# Altium schematic sheet FPGA.SchDoc
size A2; Author: ALTIUM GOSTBOM2.0 KEV; SheetNumber: 2; SheetTotal: 7
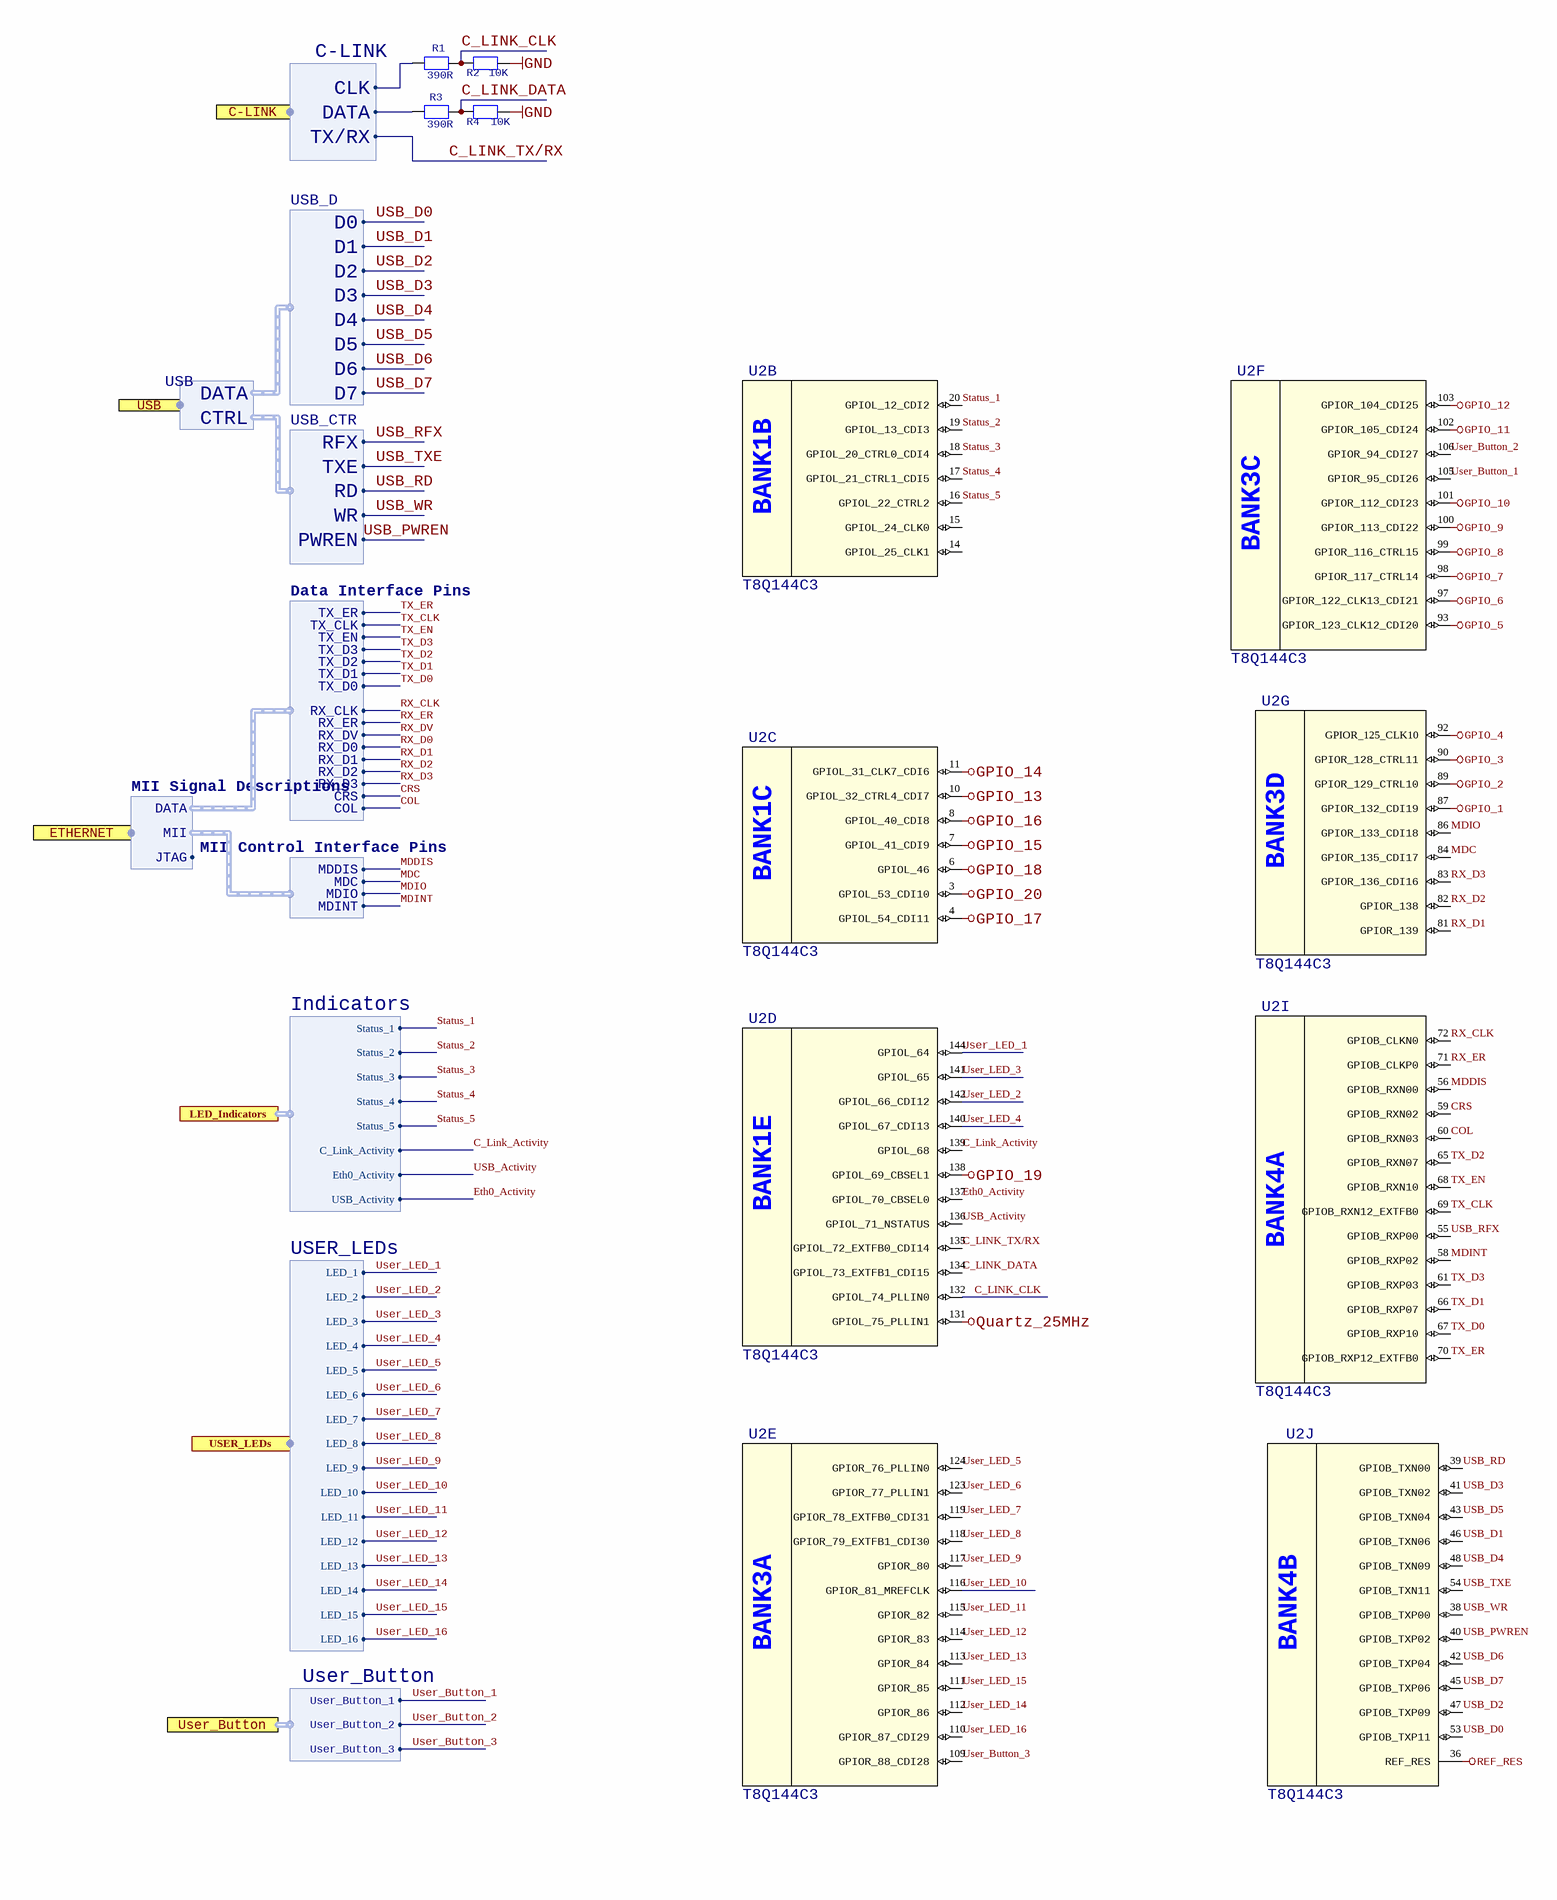
[diagram p0: FPGA.SchDoc, left]
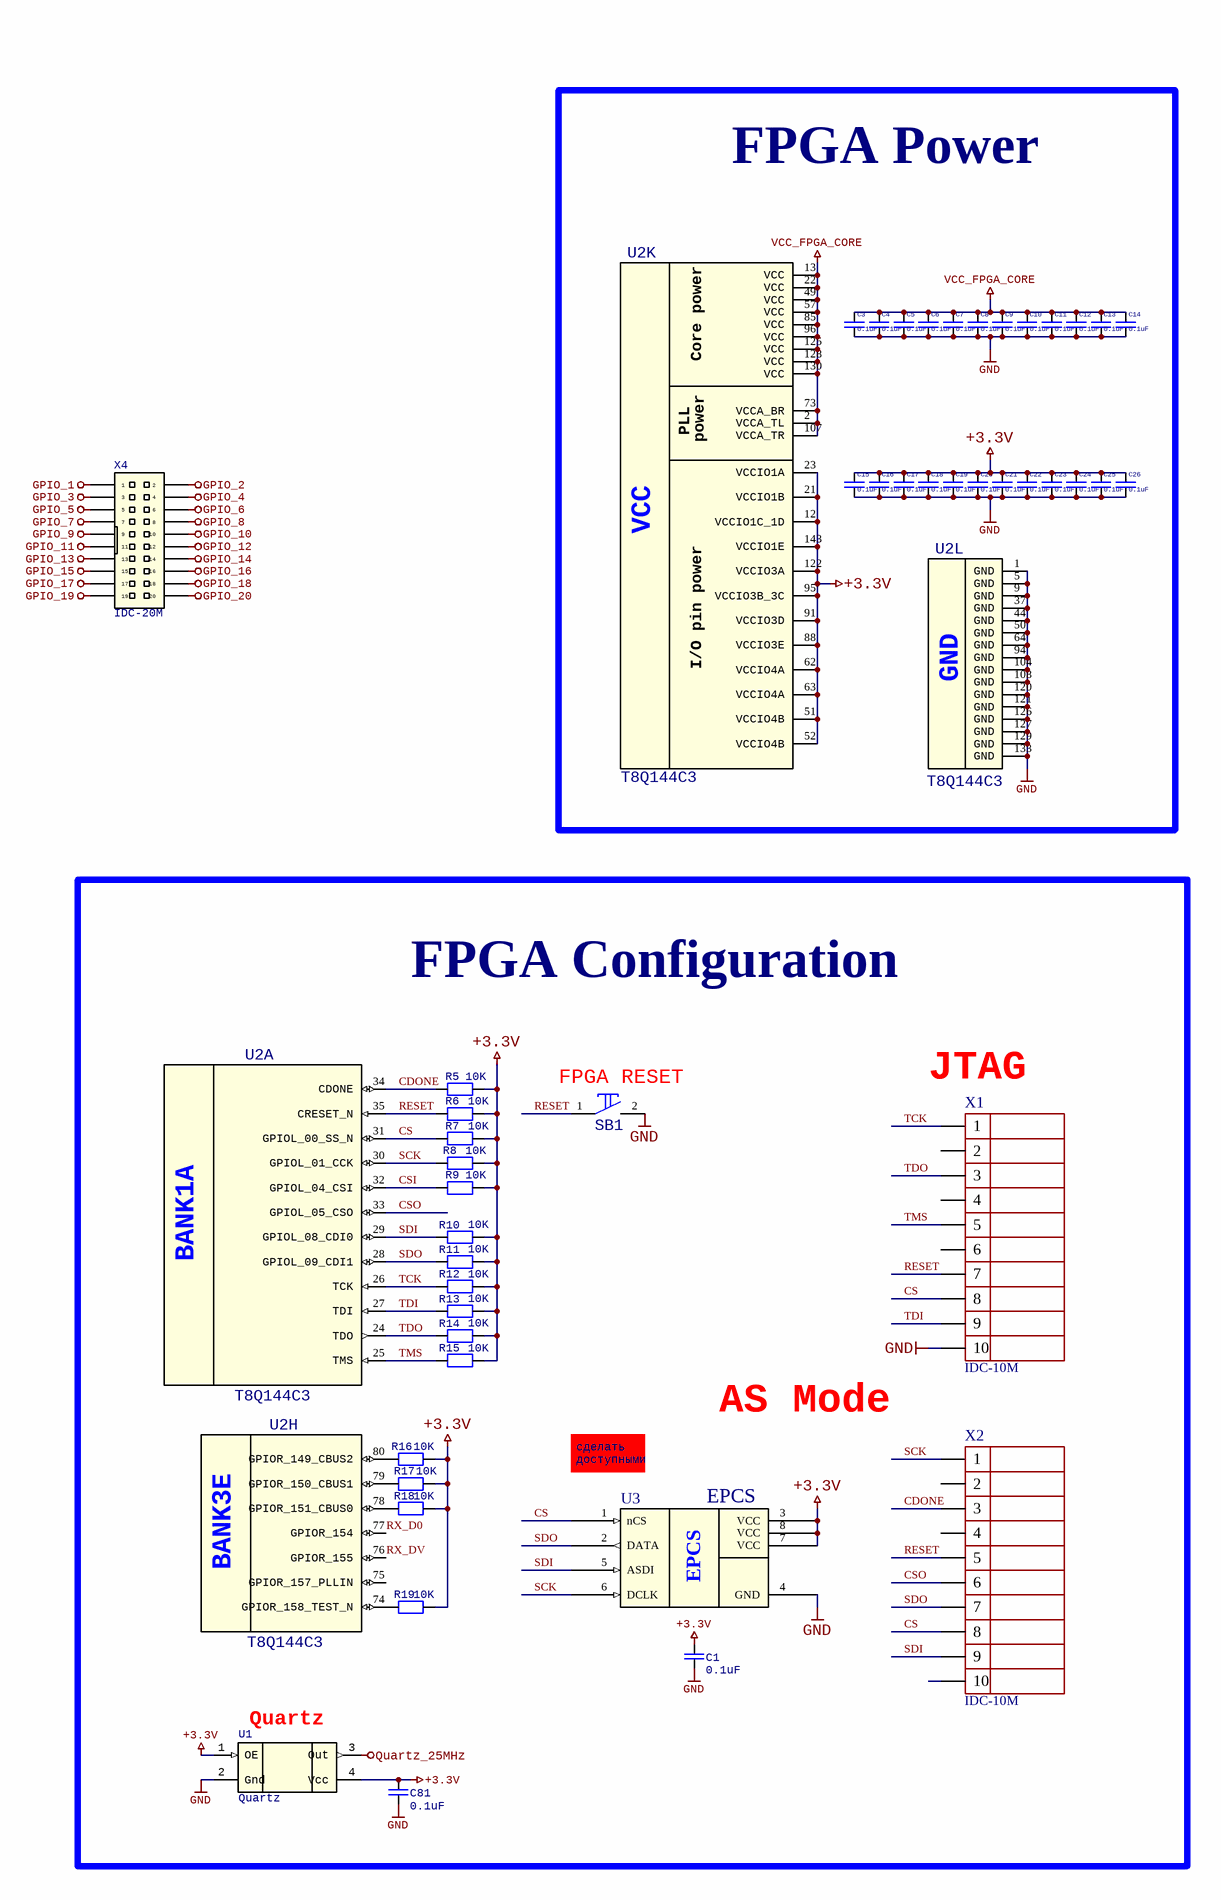
[diagram p1: FPGA.SchDoc, right]

## Parts
C1  0.1uF  [C_0603]
C3  0.1uF  [C_0603]
C4  0.1uF  [C_0603]
C5  0.1uF  [C_0603]
C6  0.1uF  [C_0603]
C7  0.1uF  [C_0603]
C8  0.1uF  [C_0603]
C9  0.1uF  [C_0603]
C10  0.1uF  [C_0603]
C11  0.1uF  [C_0603]
C12  0.1uF  [C_0603]
C13  0.1uF  [C_0603]
C14  0.1uF  [C_0603]
C15  0.1uF  [C_0603]
C16  0.1uF  [C_0603]
C17  0.1uF  [C_0603]
C18  0.1uF  [C_0603]
C19  0.1uF  [C_0603]
C20  0.1uF  [C_0603]
C21  0.1uF  [C_0603]
C22  0.1uF  [C_0603]
C23  0.1uF  [C_0603]
C24  0.1uF  [C_0603]
C25  0.1uF  [C_0603]
C26  0.1uF  [C_0603]
C81  0.1uF  [C_0603]
R1  390R  [R_0603]
R2  10K  [R_0603]
R3  390R  [R_0603]
R4  10K  [R_0603]
R5  10K  [R_0603]
R6  10K  [R_0603]
R7  10K  [R_0603]
R8  10K  [R_0603]
R9  10K  [R_0603]
R10  10K  [R_0603]
R11  10K  [R_0603]
R12  10K  [R_0603]
R13  10K  [R_0603]
R14  10K  [R_0603]
R15  10K  [R_0603]
R16  10K  [R_0603]
R17  10K  [R_0603]
R18  10K  [R_0603]
R19  10K  [R_0603]
SB1  Text  [DTS-32]  (value not drawn)
U1  Quartz  [SMD_Qz_7mmX5mm]
U2  T8Q144C3  [LQFP- 144]  (parts A,B,C,D,E,F,G,H,I,J,K,L of 12)
U3  EPCS  [SOIC8_N]
X1  IDC-10M  [IDC-10MS]
X2  IDC-10M  [IDC-10MS]
X4  IDC-20M  [IDC-20]

## Blocks framed on the sheet
FPGA Power: C3-C26 U2
FPGA Configuration: C1 C81 R5-R19 SB1 U1-U3 X1 X2

## Ports
C-LINK (harness C-LINK), ETHERNET (harness MII Signal Descriptions), LED_Indicators (harness Indicators), USB (harness USB), User_Button (harness User_Button), USER_LEDs (harness USER_LEDs)

## Harnesses
C-LINK: CLK, DATA, TX/RX
USB_D: D0, D1, D2, D3, D4, D5, D6, D7
USB_CTR: RFX, TXE, RD, WR, PWREN
USB: DATA, CTRL
MII Control Interface Pins: MDDIS, MDC, MDIO, MDINT
Data Interface Pins: TX_ER, TX_CLK, TX_EN, TX_D3, TX_D2, TX_D1, TX_D0, RX_CLK, RX_ER, RX_DV, RX_D0, RX_D1, RX_D2, RX_D3, CRS, COL
MII Signal Descriptions: MII, DATA, JTAG
USER_LEDs: LED_1, LED_2, LED_3, LED_4, LED_5, LED_6, LED_7, LED_8, LED_9, LED_10, LED_11, LED_12, LED_13, LED_14, LED_15, LED_16
User_Button: User_Button_1, User_Button_2, User_Button_3
Indicators: Eth0_Activity, USB_Activity, C_Link_Activity, Status_5, Status_4, Status_3, Status_2, Status_1

## Nets
+3.3V: C1.1 C15.1 C16.1 C17.1 C18.1 C19.1 C20.1 C21.1 C22.1 C23.1 C24.1 C25.1 C26.1 C81.2 R5.2 R6.2 R7.2 R8.2 R9.2 R10.2 R11.2 R12.2 R13.2 R14.2 R15.2 R16.2 R17.2 R18.2 R19.2 U1.1(OE) U1.4(Vcc) U2.12(VCCIO1C_1D) U2.21(VCCIO1B) U2.23(VCCIO1A) U2.51(VCCIO4B) U2.52(VCCIO4B) U2.62(VCCIO4A) U2.63(VCCIO4A) U2.88(VCCIO3E) U2.91(VCCIO3D) U2.95(VCCIO3B_3C) U2.122(VCCIO3A) U2.143(VCCIO1E) U3.3(VCC) U3.7(VCC) U3.8(VCC)
GND: C1.2 C3.2 C4.2 C5.2 C6.2 C7.2 C8.2 C9.2 C10.2 C11.2 C12.2 C13.2 C14.2 C15.2 C16.2 C17.2 C18.2 C19.2 C20.2 C21.2 C22.2 C23.2 C24.2 C25.2 C26.2 C81.1 R2.2 R4.2 SB1.2 U1.2(Gnd) U2.1(GND) U2.5(GND) U2.9(GND) U2.37(GND) U2.44(GND) U2.50(GND) U2.64(GND) U2.94(GND) U2.104(GND) U2.108(GND) U2.120(GND) U2.121(GND) U2.126(GND) U2.127(GND) U2.129(GND) U2.133(GND) U3.4(GND) X1.10
GPIO_1: U2.87(GPIOR_132_CDI19) X4.1
GPIO_2: U2.89(GPIOR_129_CTRL10) X4.2
GPIO_3: U2.90(GPIOR_128_CTRL11) X4.3
GPIO_4: U2.92(GPIOR_125_CLK10) X4.4
GPIO_5: U2.93(GPIOR_123_CLK12_CDI20) X4.5
GPIO_6: U2.97(GPIOR_122_CLK13_CDI21) X4.6
GPIO_7: U2.98(GPIOR_117_CTRL14) X4.7
GPIO_8: U2.99(GPIOR_116_CTRL15) X4.8
GPIO_9: U2.100(GPIOR_113_CDI22) X4.9
GPIO_10: U2.101(GPIOR_112_CDI23) X4.10
GPIO_11: U2.102(GPIOR_105_CDI24) X4.11
GPIO_12: U2.103(GPIOR_104_CDI25) X4.12
GPIO_13: U2.10(GPIOL_32_CTRL4_CDI7) X4.13
GPIO_14: U2.11(GPIOL_31_CLK7_CDI6) X4.14
GPIO_15: U2.7(GPIOL_41_CDI9) X4.15
GPIO_16: U2.8(GPIOL_40_CDI8) X4.16
GPIO_17: U2.4(GPIOL_54_CDI11) X4.17
GPIO_18: U2.6(GPIOL_46) X4.18
GPIO_19: U2.138(GPIOL_69_CBSEL1) X4.19
GPIO_20: U2.3(GPIOL_53_CDI10) X4.20
Quartz_25MHz: U1.3(Out) U2.131(GPIOL_75_PLLIN1)
REF_RES: U2.36(REF_RES)
VCC_FPGA_CORE: C3.1 C4.1 C5.1 C6.1 C7.1 C8.1 C9.1 C10.1 C11.1 C12.1 C13.1 C14.1 U2.2(VCCA_TL) U2.13(VCC) U2.22(VCC) U2.49(VCC) U2.57(VCC) U2.73(VCCA_BR) U2.85(VCC) U2.96(VCC) U2.107(VCCA_TR) U2.125(VCC) U2.128(VCC) U2.130(VCC)
C_Link_Activity: U2.139(GPIOL_68) ; port LED_Indicators.C_Link_Activity
C_LINK_CLK: R1.2 R2.1 U2.132(GPIOL_74_PLLIN0)
C_LINK_DATA: R3.2 R4.1 U2.134(GPIOL_73_EXTFB1_CDI15)
C_LINK_TX/RX: U2.135(GPIOL_72_EXTFB0_CDI14) ; port C-LINK.TX/RX
CDONE: R5.1 U2.34(CDONE) X2.3
COL: U2.60(GPIOB_RXN03) ; harness Data Interface Pins.COL
CRS: U2.59(GPIOB_RXN02) ; harness Data Interface Pins.CRS
CS: R7.1 U2.31(GPIOL_00_SS_N) U3.1(nCS) X1.8 X2.8
CSI: R9.1 U2.32(GPIOL_04_CSI)
CSO: U2.33(GPIOL_05_CSO) X2.6
Eth0_Activity: U2.137(GPIOL_70_CBSEL0) ; port LED_Indicators.USB_Activity
MDC: U2.84(GPIOR_135_CDI17) ; harness MII Control Interface Pins.MDC
MDDIS: U2.56(GPIOB_RXN00) ; harness MII Control Interface Pins.MDDIS
MDINT: U2.58(GPIOB_RXP02) ; harness MII Control Interface Pins.MDINT
MDIO: U2.86(GPIOR_133_CDI18) ; harness MII Control Interface Pins.MDIO
RESET: R6.1 SB1.1 U2.35(CRESET_N) X1.7 X2.5
RX_CLK: U2.72(GPIOB_CLKN0) ; harness Data Interface Pins.RX_CLK
RX_D0: U2.77(GPIOR_154) ; harness Data Interface Pins.RX_D0
RX_D1: U2.81(GPIOR_139) ; harness Data Interface Pins.RX_D1
RX_D2: U2.82(GPIOR_138) ; harness Data Interface Pins.RX_D2
RX_D3: U2.83(GPIOR_136_CDI16) ; harness Data Interface Pins.RX_D3
RX_DV: U2.76(GPIOR_155) ; harness Data Interface Pins.RX_DV
RX_ER: U2.71(GPIOB_CLKP0) ; harness Data Interface Pins.RX_ER
SCK: R8.1 U2.30(GPIOL_01_CCK) U3.6(DCLK) X2.1
SDI: R10.1 U2.29(GPIOL_08_CDI0) U3.5(ASDI) X2.9
SDO: R11.1 U2.28(GPIOL_09_CDI1) U3.2(DATA) X2.7
Status_1: U2.20(GPIOL_12_CDI2) ; port LED_Indicators.Status_1
Status_2: U2.19(GPIOL_13_CDI3) ; port LED_Indicators.Status_2
Status_3: U2.18(GPIOL_20_CTRL0_CDI4) ; port LED_Indicators.Status_3
Status_4: U2.17(GPIOL_21_CTRL1_CDI5) ; port LED_Indicators.Status_4
Status_5: U2.16(GPIOL_22_CTRL2) ; port LED_Indicators.Status_5
TCK: R12.1 U2.26(TCK) X1.1
TDI: R13.1 U2.27(TDI) X1.9
TDO: R14.1 U2.24(TDO) X1.3
TMS: R15.1 U2.25(TMS) X1.5
TX_CLK: U2.69(GPIOB_RXN12_EXTFB0) ; harness Data Interface Pins.TX_CLK
TX_D0: U2.67(GPIOB_RXP10) ; harness Data Interface Pins.TX_D0
TX_D1: U2.66(GPIOB_RXP07) ; harness Data Interface Pins.TX_D1
TX_D2: U2.65(GPIOB_RXN07) ; harness Data Interface Pins.TX_D2
TX_D3: U2.61(GPIOB_RXP03) ; harness Data Interface Pins.TX_D3
TX_EN: U2.68(GPIOB_RXN10) ; harness Data Interface Pins.TX_EN
TX_ER: U2.70(GPIOB_RXP12_EXTFB0) ; harness Data Interface Pins.TX_ER
USB_Activity: U2.136(GPIOL_71_NSTATUS) ; port LED_Indicators.Eth0_Activity
USB_D0: U2.53(GPIOB_TXP11) ; harness USB_D.D0
USB_D1: U2.46(GPIOB_TXN06) ; harness USB_D.D1
USB_D2: U2.47(GPIOB_TXP09) ; harness USB_D.D2
USB_D3: U2.41(GPIOB_TXN02) ; harness USB_D.D3
USB_D4: U2.48(GPIOB_TXN09) ; harness USB_D.D4
USB_D5: U2.43(GPIOB_TXN04) ; harness USB_D.D5
USB_D6: U2.42(GPIOB_TXP04) ; harness USB_D.D6
USB_D7: U2.45(GPIOB_TXP06) ; harness USB_D.D7
USB_PWREN: U2.40(GPIOB_TXP02) ; harness USB_CTR.PWREN
USB_RD: U2.39(GPIOB_TXN00) ; harness USB_CTR.RD
USB_RFX: U2.55(GPIOB_RXP00) ; harness USB_CTR.RFX
USB_TXE: U2.54(GPIOB_TXN11) ; harness USB_CTR.TXE
USB_WR: U2.38(GPIOB_TXP00) ; harness USB_CTR.WR
User_Button_1: U2.105(GPIOR_95_CDI26) ; port User_Button.User_Button_1
User_Button_2: U2.106(GPIOR_94_CDI27) ; port User_Button.User_Button_2
User_Button_3: U2.109(GPIOR_88_CDI28) ; port User_Button.User_Button_3
User_LED_1: U2.144(GPIOL_64) ; port USER_LEDs.LED_1
User_LED_2: U2.142(GPIOL_66_CDI12) ; port USER_LEDs.LED_2
User_LED_3: U2.141(GPIOL_65) ; port USER_LEDs.LED_3
User_LED_4: U2.140(GPIOL_67_CDI13) ; port USER_LEDs.LED_4
User_LED_5: U2.124(GPIOR_76_PLLIN0) ; port USER_LEDs.LED_5
User_LED_6: U2.123(GPIOR_77_PLLIN1) ; port USER_LEDs.LED_6
User_LED_7: U2.119(GPIOR_78_EXTFB0_CDI31) ; port USER_LEDs.LED_7
User_LED_8: U2.118(GPIOR_79_EXTFB1_CDI30) ; port USER_LEDs.LED_8
User_LED_9: U2.117(GPIOR_80) ; port USER_LEDs.LED_9
User_LED_10: U2.116(GPIOR_81_MREFCLK) ; port USER_LEDs.LED_10
User_LED_11: U2.115(GPIOR_82) ; port USER_LEDs.LED_11
User_LED_12: U2.114(GPIOR_83) ; port USER_LEDs.LED_12
User_LED_13: U2.113(GPIOR_84) ; port USER_LEDs.LED_13
User_LED_14: U2.112(GPIOR_86) ; port USER_LEDs.LED_14
User_LED_15: U2.111(GPIOR_85) ; port USER_LEDs.LED_15
User_LED_16: U2.110(GPIOR_87_CDI29) ; port USER_LEDs.LED_16
NetR1_1: R1.1 ; port C-LINK.CLK
NetR3_1: R3.1 ; port C-LINK.DATA
NetR16_1: R16.1 U2.80(GPIOR_149_CBUS2)
NetR17_1: R17.1 U2.79(GPIOR_150_CBUS1)
NetR18_1: R18.1 U2.78(GPIOR_151_CBUS0)
NetR19_1: R19.1 U2.74(GPIOR_158_TEST_N)

Not connected (* = marked no-connect by the designer): U2 14(GPIOL_25_CLK1) 15(GPIOL_24_CLK0) 75(GPIOR_157_PLLIN); X1 2 4 6; X2 2 4 10

## Notes on the sheet
- (near SB1) FPGA RESET
- (near X1) JTAG
- AS Mode
- (near U3) сделать доступными для резки
- (near U1) Quartz
- Перв. примен.
- Справ. №
- Подп. дата
- Инв. № дубл.
- Взам. инв. №
- Подп. и дата
- Изм.
- Разраб.
- Лист
- № докум.
- Подп.
- Дата
- Лит.
- Масса
- Масштаб
- Пров.
- Т.контр.
- Листов
- Инв. № подл.
- Н.контр.
- Утв.
- ALTIUM GOSTBOM2.0 KEV
- Файл:
- Копировал
- Формат А3
- (in symbol Trion_T8Q144 FPGA, part A) BANK1A
- (in symbol Trion_T8Q144 FPGA, part B) BANK1B
- (in symbol Trion_T8Q144 FPGA, part C) BANK1C
- (in symbol Trion_T8Q144 FPGA, part D) BANK1E
- (in symbol Trion_T8Q144 FPGA, part E) BANK3A
- (in symbol Trion_T8Q144 FPGA, part F) BANK3C
- (in symbol Trion_T8Q144 FPGA, part G) BANK3D
- (in symbol Trion_T8Q144 FPGA, part H) BANK3E
- (in symbol Trion_T8Q144 FPGA, part I) BANK4A
- (in symbol Trion_T8Q144 FPGA, part J) BANK4B
- (in symbol Trion_T8Q144 FPGA, part K) Core power; PLL; power; I/O pin power

## Library data of the parts
C1 C3-C26 C81 = C: Non-polarised capacitor; ComponentLink1Description: Manufacturer Link; ComponentLink1URL: www.murata.com; ComponentLink2Description: Datasheet Link; ComponentLink2URL: http://www.murata.com/products/catalog/pdf/c02e.pdf; ValueSCH: *
R1-R19 = R
SB1 = Button: Published: 17.04.2014; Publisher: Andrew Danich; Type: Переключатель
U1 = Quartz: Crystal Oscillator (SMD)
U2 = Trion_T8Q144 FPGA: Trion T8 FPGA
U3 = EPCS: Serial Configuration (EPCS) Devices